# EAGLE design arduino_aprs_modem - corrected (EAGLE 9.6.2)
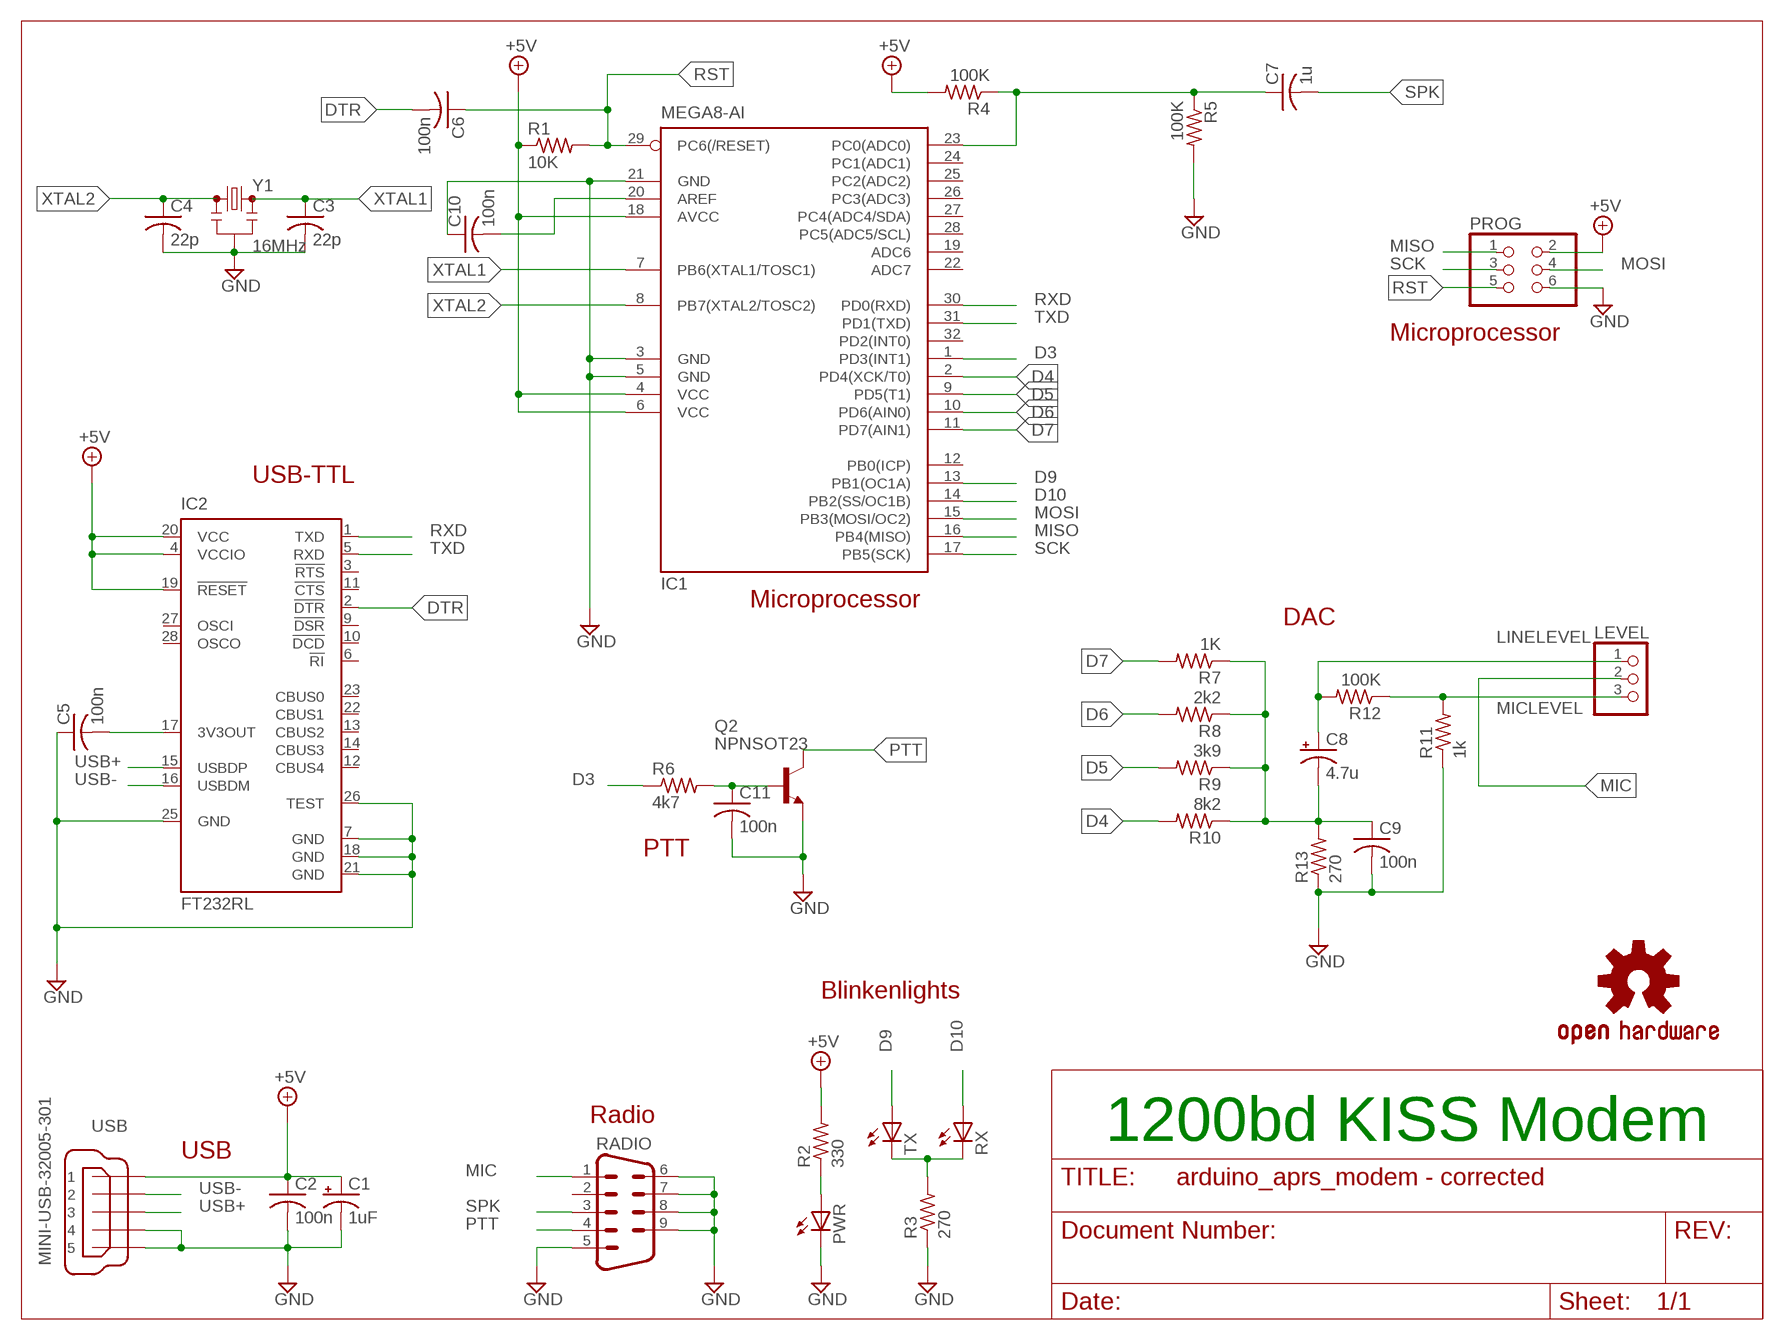
[diagram p0: schematic, sheet 1]

## Parts
C1  1uF  CPOL-USE2-5  [E2-5]
C2  100n  C-USC0805  [C0805]
C3  22p  C-USC0805  [C0805]
C4  22p  C-USC0805  [C0805]
C5  100n  C-USC0805  [C0805]
C6  100n  C-USC0805  [C0805]
C7  1u  C-USC0805  [C0805]
C8  4.7u  CPOL-USE2-5  [E2-5]
C9  100n  C-USC0805  [C0805]
C10  100n  C-USC0805  [C0805]
C11  100n  C-USC0805  [C0805]
IC1  MEGA8-AI  [TQFP32-08]
IC2  FT232RL  [SSOP28]
LEVEL  PINHD-1X3  [1X03]
PROG  PINHD-2X3  [2X03]
PWR  LEDCHIPLED_0805  [CHIPLED_0805]
Q2  NPNSOT23  [SOT23]
R1  10K  R-US_M0805  [M0805]
R2  330  R-US_M0805  [M0805]
R3  270  R-US_M0805  [M0805]
R4  100K  R-US_M0805  [M0805]
R5  100K  R-US_M0805  [M0805]
R6  4k7  R-US_M0805  [M0805]
R7  1K  R-US_M0805  [M0805]
R8  2k2  R-US_M0805  [M0805]
R9  3k9  R-US_M0805  [M0805]
R10  8k2  R-US_M0805  [M0805]
R11  1k  R-US_M0805  [M0805]
R12  100K  R-US_M0805  [M0805]
R13  270  R-US_M0805  [M0805]
RADIO  M09H  [M09H]
RX  LEDCHIPLED_0805  [CHIPLED_0805]
TX  LEDCHIPLED_0805  [CHIPLED_0805]
U$1  OSHW-LOGOM  [OSHW-LOGO-M]
USB  MINI-USB-32005-301  [32005-301]
Y1  16MHz  RESONATORPTH  [RESONATOR-PTH]

## Nets
+5V: C1.+ C2.1 IC1.4(VCC) IC1.6(VCC) IC1.18(AVCC) IC2.4(VCCIO) IC2.19(!RESET) IC2.20(VCC) PROG.2 R1.1 R2.2 R4.2 USB.1
D3: IC1.1(PD3(INT1)) R6.1
D4: IC1.2(PD4(XCK/T0)) R10.2
D5: IC1.9(PD5(T1)) R9.2
D6: IC1.10(PD6(AIN0)) R8.2
D7: IC1.11(PD7(AIN1)) R7.2
D9: IC1.13(PB1(OC1A)) TX.A
D10: IC1.14(PB2(SS/OC1B)) RX.A
DTR: C6.2 IC2.2(!DTR)
GND: C1.- C2.2 C3.2 C4.2 C5.1 C9.2 C10.1 C11.2 IC1.3(GND) IC1.5(GND) IC1.21(GND) IC2.7(GND) IC2.18(GND) IC2.21(GND) IC2.25(GND) IC2.26(TEST) PROG.6 PWR.C Q2.2(E) R3.1 R5.2 R11.1 R13.1 RADIO.5 RADIO.6 RADIO.7 RADIO.8 RADIO.9 USB.4 USB.5 Y1.2
LINELEVEL: C8.+ LEVEL.1 R12.2
MIC: LEVEL.2 RADIO.1
MICLEVEL: LEVEL.3 R11.2 R12.1
MISO: IC1.16(PB4(MISO)) PROG.1
MOSI: IC1.15(PB3(MOSI/OC2)) PROG.4
N$1: C10.2 IC1.20(AREF)
N$2: PWR.A R2.1
N$3: R3.2 RX.C TX.C
N$6: C7.1 IC1.23(PC0(ADC0)) R4.1 R5.1
N$7: C11.1 Q2.1(B) R6.2
N$9: C5.2 IC2.17(3V3OUT)
N$13: C8.- C9.1 R7.1 R8.1 R9.1 R10.1 R13.2
PTT: Q2.3(C) RADIO.4
RST: C6.1 IC1.29(PC6(/RESET)) PROG.5 R1.2
RXD: IC1.30(PD0(RXD)) IC2.1(TXD)
SCK: IC1.17(PB5(SCK)) PROG.3
SPK: C7.2 RADIO.3
TXD: IC1.31(PD1(TXD)) IC2.5(RXD)
USB+: IC2.15(USBDP) USB.3
USB-: IC2.16(USBDM) USB.2
XTAL1: C3.1 IC1.7(PB6(XTAL1/TOSC1)) Y1.3
XTAL2: C4.1 IC1.8(PB7(XTAL2/TOSC2)) Y1.1
Unconnected: IC1.12(PB0(ICP)) IC1.19(ADC6) IC1.22(ADC7) IC1.24(PC1(ADC1)) IC1.25(PC2(ADC2)) IC1.26(PC3(ADC3)) IC1.27(PC4(ADC4/SDA)) IC1.28(PC5(ADC5/SCL)) IC1.32(PD2(INT0)) IC2.3(!RTS) IC2.6(!RI) IC2.9(!DSR) IC2.10(!DCD) IC2.11(!CTS) IC2.12(CBUS4) IC2.13(CBUS2) IC2.14(CBUS3) IC2.22(CBUS1) IC2.23(CBUS0) IC2.27(OSCI) IC2.28(OSCO) RADIO.2

## Notes on the sheet
- Microprocessor
- USB-TTL
- Microprocessor
- DAC
- PTT
- Blinkenlights
- Radio
- 1200bd KISS Modem
- USB

## Library data of the parts
C1 C8 = rcl:CPOL-US: POLARIZED CAPACITOR, American symbol
C2-C7 C9-C11 = rcl:C-US: CAPACITOR, American symbol
IC1 = atmel:MEGA8: MICROCONTROLLER 8 Kbytes FLASH, 1 kbytes SRAM, 512 bytes EEPROM, USART, 6-channel 10 bit ADC, 2-channel 8 bit ADC Pin compatible with Atmega48, ATMega88, ATMega168 Source: avr.lbr; MPN: ATMEGA8-16AU; OC_FARNELL: 9171371; OC_NEWARK: 73M8863
IC2 = ftdichip:FT232R: Source: http://www.ftdichip.com/Documents/DataSheets/DS_FT232R_v104.pdf; MPN: FT232RL; OC_FARNELL: 1146032; OC_NEWARK: 91K9918
LEVEL = pinhead:PINHD-1X3: PIN HEADER
PROG = pinhead:PINHD-2X3: PIN HEADER
PWR RX TX = led:LED: LED OSRAM: - CHIPLED LG R971, LG N971, LY N971, LG Q971, LY Q971, LO R971, LY R971 LH N974, LH R974 LS Q976, LO Q976, LY Q976 LO Q996 - Hyper CHIPLED LW Q18S LB Q993, LB Q99A, LB R99A - SideLED LS A670, LO A670, LY A670, LG A670, LP A670 LB A673, LV A673, LT A673, LW A673 LH A674 LY A675 LS A676, LA A676, LO A676, LY A676, LW A676 LS A679, LY A679, LG A679 - Hyper Micro SIDELED® LS Y876, LA Y876, LO Y876, LY Y876 LT Y87S - SmartLED LW L88C, LW L88S LB L89C, LB L89S, LG L890 LS L89K, LO L89K, LY L89K LS L896, LA L896, LO L896, LY L896 - TOPLED LS T670, LO T670, LY T670, LG T670, LP T670 LSG T670, LSP T670, LSY T670, LOP T670, LYG T670 LG T671, LOG T671, LSG T671 LB T673, LV T673, LT T673, LW T673 LH T674 LS T676, LA T676, LO T676, LY T676, LB T676, LH T676, LSB T676, LW T676 LB T67C, LV T67C, LT T67C, LS T67K, LO T67K, LY T67K, LW E67C LS E67B, LA E67B, LO E67B, LY E67B, LB E67C, LV E67C, LT E67C LW T67C LS T679, LY T679, LG T679 LS T770, LO T770, LY T770, LG T770, LP T770 LB T773, LV T773, LT T773, LW T773 LH T774 LS E675, LA E675, LY E675, LS T675 LS T776, LA T776, LO T776, LY T776, LB T776 LHGB T686 LT T68C, LB T68C - Hyper Mini TOPLED® LB M676 - Mini TOPLED Santana® LG M470 LS M47K, LO M47K, LY M47K Source: http://www.osram.convergy.de LUXEON: - LUMILED® LXK2-PW12-R00, LXK2-PW12-S00, LXK2-PW14-U00, LXK2-PW14-V00 LXK2-PM12-R00, LXK2-PM12-S00, LXK2-PM14-U00 LXK2-PE12-Q00, LXK2-PE12-R00, LXK2-PE12-S00, LXK2-PE14-T00, LXK2-PE14-U00 LXK2-PB12-K00, LXK2-PB12-L00, LXK2-PB12-M00, LXK2-PB14-N00, LXK2-PB14-P00, LXK2-PB14-Q00 LXK2-PR12-L00, LXK2-PR12-M00, LXK2-PR14-Q00, LXK2-PR14-R00 LXK2-PD12-Q00, LXK2-PD12-R00, LXK2-PD12-S00 LXK2-PH12-R00, LXK2-PH12-S00 LXK2-PL12-P00, LXK2-PL12-Q00, LXK2-PL12-R00 Source: www.luxeon.com KINGBRIGHT: KA-3528ASYC Source: www.kingbright.com
Q2 = Jim:NPN: NPN Transistor
R1-R13 = resistor:R-US_: RESISTOR, American symbol
RADIO = con-subd:M09: SUB-D; OC_FARNELL: unknown; OC_NEWARK: unknown
U$1 = SparkFun:OSHW-LOGO: Open Source Hardware Logo This logo indicates the piece of hardware it is found on incorporates a OSHW license and/or adheres to the definition of open source hardware found here: http://freedomdefined.org/OSHW
USB = con-cypressindustries:MINI-USB-: MINI USB-B Conector Source: www.cypressindustries.com; OC_FARNELL: unknown; OC_NEWARK: unknown
Y1 = SparkFun-FreqCtrl:RESONATOR: Resonator Small SMD resonator. Used, eg, on the Arduino Pro/ Pro Mini boards. 8MHz- XTAL-08895 16MHz- XTAL-08900

## Board
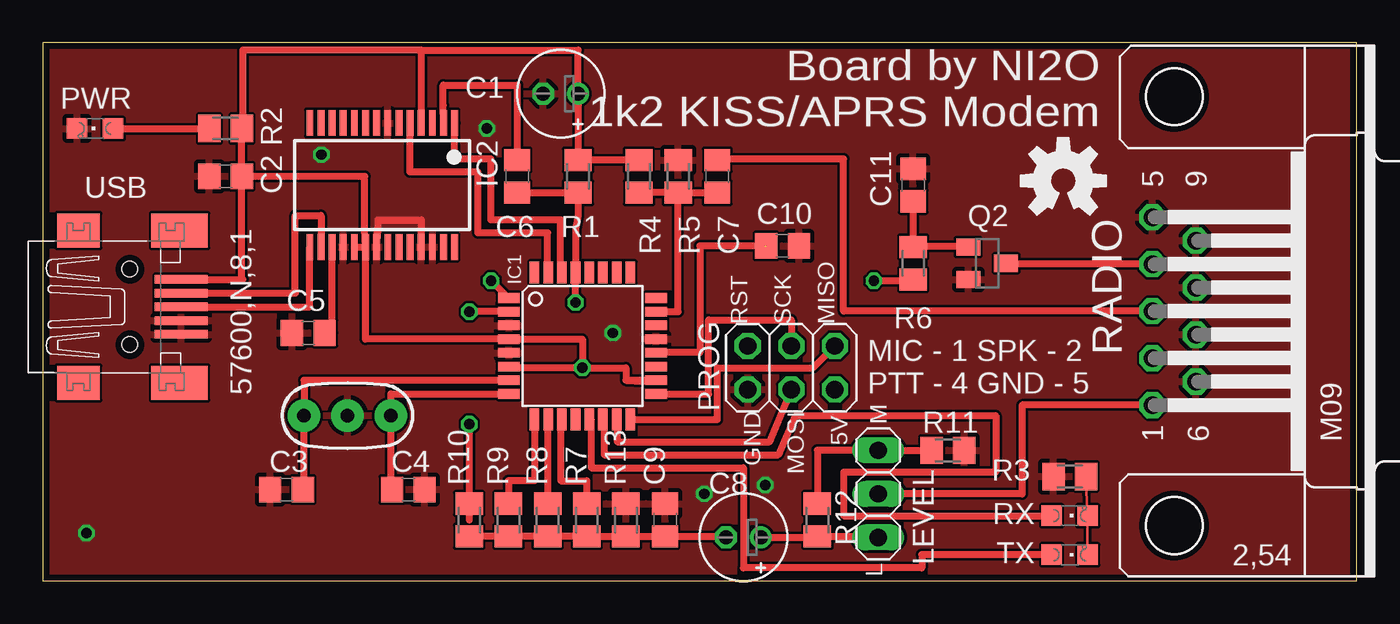
[diagram p1: board, top side]
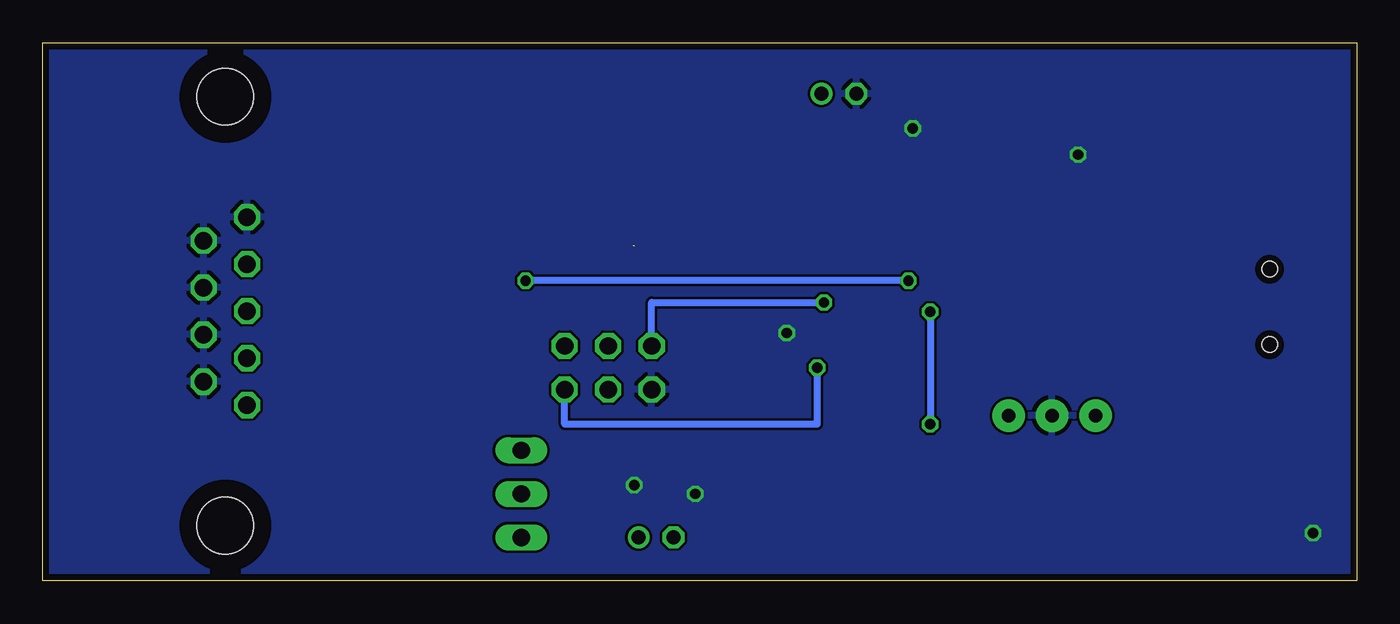
[diagram p2: board, bottom side, seen from below]

Size 76.69 x 31.42 mm. Coordinates in mm from the lower left corner, seen from the top.
Outline: 0,0 76.69,0 76.69,31.42 0,31.42 0,0
Copper layers (1*16): Top 0.0356mm / dielectric 1.5011mm / Bottom 0.0356mm
Design rules "LaenPCBOrder": minimum track width 6mil, minimum drill 13mil, track to track 6mil, track to pad 6mil, pad to pad 6mil, via to via 6mil, smd to smd 6mil, copper to edge 15mil, drill to drill 6mil, minimum pad ring 7mil, minimum via ring 7mil, stop-mask expansion 3mil, vias tented up to drill 0mil, thermal gap 10mil

### Footprints (pad centres in the part's own frame; a part is rotated, then mirrored left to right if it is on the bottom)
E2-5 = drill 0.813 pad 1.27: + -1.016,0 | drill 0.813 pad 1.27 octagon: - 1.016,0
C0805 = smd 1.3 x 1.5: 1 -0.95,0; 2 0.95,0
TQFP32-08 = smd 1.27 x 0.559: 1 -4.293,2.8; 2 -4.293,2; 3 -4.293,1.2; 4 -4.293,0.4; 5 -4.293,-0.4; 6 -4.293,-1.2; 7 -4.293,-2; 8 -4.293,-2.8; 17 4.293,-2.8; 18 4.293,-2; 19 4.293,-1.2; 20 4.293,-0.4; 21 4.293,0.4; 22 4.293,1.2; 23 4.293,2; 24 4.293,2.8 | smd 0.559 x 1.27: 9 -2.8,-4.293; 10 -2,-4.293; 11 -1.2,-4.293; 12 -0.4,-4.293; 13 0.4,-4.293; 14 1.2,-4.293; 15 2,-4.293; 16 2.8,-4.293; 25 2.8,4.293; 26 2,4.293; 27 1.2,4.293; 28 0.4,4.293; 29 -0.4,4.293; 30 -1.2,4.293; 31 -2,4.293; 32 -2.8,4.293
SSOP28 = smd 0.4 x 1.5: 1 -4.225,-3.625; 2 -3.575,-3.625; 3 -2.925,-3.625; 4 -2.275,-3.625; 5 -1.625,-3.625; 6 -0.975,-3.625; 7 -0.325,-3.625; 8 0.325,-3.625; 9 0.975,-3.625; 10 1.625,-3.625; 11 2.275,-3.625; 12 2.925,-3.625; 13 3.575,-3.625; 14 4.225,-3.625; 15 4.225,3.625; 16 3.575,3.625; 17 2.925,3.625; 18 2.275,3.625; 19 1.625,3.625; 20 0.975,3.625; 21 0.325,3.625; 22 -0.325,3.625; 23 -0.975,3.625; 24 -1.625,3.625; 25 -2.275,3.625; 26 -2.925,3.625; 27 -3.575,3.625; 28 -4.225,3.625
1X03 = drill 1.016 long: 1 -2.54,0; 2 0,0; 3 2.54,0
2X03 = drill 1.016 octagon: 1 -2.54,-1.27; 2 -2.54,1.27; 3 0,-1.27; 4 0,1.27; 5 2.54,-1.27; 6 2.54,1.27
CHIPLED_0805 = smd 1.2 x 1.2: A 0,-1.05; C 0,1.05
SOT23 = smd 1 x 1.4: 1 -0.95,-1.1; 2 0.95,-1.1; 3 0,1.1
M0805 = smd 1.3 x 1.6: 1 -0.95,0; 2 0.95,0
M09H = drill 1.016 octagon: 1 -5.486,1.27; 2 -2.743,1.27; 3 0,1.27; 4 2.743,1.27; 5 5.486,1.27; 6 -4.115,-1.27; 7 -1.372,-1.27; 8 1.372,-1.27; 9 4.115,-1.27 | hole 3.302: 12.522,0; -12.522,0
32005-301 = smd 3.1 x 0.5: 1 3,1.6; 2 3,0.8; 3 3,0; 4 3,-0.8; 5 3,-1.6 | smd 2.5 x 2: M1 -3,-4.45; M2 -3,4.45 | smd 3.3 x 2: M3 2.9,4.45; M4 2.9,-4.45 | hole 0.9: 0,2.2; 0,-2.2
RESONATOR-PTH = drill 0.8 pad 1.88: 1 -2.54,0; 2 0,0; 3 2.54,0

### Placement (x,y rotation side)
C1  30.23,28.45 180 top
C2  10.67,23.62 180 top
C3  14.22,5.33 180 top
C4  21.34,5.33 0 top
C5  15.49,14.48 0 top
C6  27.69,23.62 90 top
C7  39.37,23.62 90 top
C8  40.89,2.54 180 top
C9  36.32,3.56 90 top
C10  43.18,19.56 180 top
C11  50.8,23.11 90 top
IC1  31.5,13.72 0 top
IC2  19.81,23.11 180 top
LEVEL  48.77,5.08 90 top
PROG  43.69,12.45 180 top
PWR  3.05,26.42 90 top
Q2  55.12,18.54 270 top
R1  31.24,23.62 270 top
R2  10.67,26.42 0 top
R3  59.94,6.1 0 top
R4  34.8,23.62 90 top
R5  37.08,23.62 90 top
R6  50.8,18.54 90 top
R7  31.75,3.56 90 top
R8  29.46,3.56 90 top
R9  27.18,3.56 90 top
R10  24.89,3.56 90 top
R11  52.83,7.62 180 top
R12  45.21,3.56 270 top
R13  34.04,3.56 270 top
RADIO  66.04,15.75 90 top
RX  59.94,3.81 270 top
TX  59.94,1.52 270 top
U$1  59.56,23.37 0 top
USB  5.08,16 0 top
Y1  17.78,9.65 180 top

### Tracks (layer width: path | path; a pad name or v marks a point on that pad's centre or on a via)
+5V  (via drill 0.6)
  Top 0.406: IC2.4 22.1,27.75 22.1,30.99 | 22.1,30.99 31.24,30.99 C1.+ R1.1 R4.2 | IC2.20 18.8,20.5 18.8,23.62 C2.1 | USB.1 11.62,17.6 | R2.2 11.68,25.91 | 11.68,17.6 11.62,17.6 | 11.62,17.6 C2.1 | C2.1 R2.2 | IC2.19 IC2.20 | 22.1,30.99 11.68,30.99 11.68,26.42 R2.2 | IC2.20 18.84,14.12 IC1.4 31.5,14.12 v31.5,12.45 | v31.5,12.45 27.2,12.45 IC1.6 | 34.04,11.72 IC1.18 35.79,11.68 34.54,11.68 34.04,11.72 | v31.5,12.45 34.04,12.45 34.04,11.72
  Bottom 0.406: v31.5,12.45 31.5,9.14 46.23,9.14 PROG.2
D3  (via drill 0.6)
  Top 0.406: IC1.1 27.18,16.52 v26.16,17.53 | v48.51,17.53 50.8,17.53 R6.1
  Bottom 0.406: v26.16,17.53 v48.51,17.53
D4  (via drill 0.6)
  Top 0.406: IC1.2 v24.89,15.72 24.89,15.75 | v24.89,9.14 R10.2 24.89,3.56
  Bottom 0.406: v24.89,15.72 v24.89,9.14
D5
  Top 0.406: IC1.9 28.7,9.17 28.7,5.84 27.18,5.84 R9.2
D6
  Top 0.406: IC1.10 29.46,9.42 R8.2
D7
  Top 0.406: IC1.11 30.23,9.42 30.23,5.84 31.75,5.84 R7.2
D9
  Top 0.406: IC1.13 32,9.42 32,6.6 40.89,6.6 40.89,0.76 51.31,0.76 51.31,1.52 TX.A
D10
  Top 0.406: IC1.14 32.77,9.42 32.77,7.37 42.93,7.37 43.94,9.65 55.63,9.65 55.63,6.35 46.74,6.35 46.74,3.81 RX.A
DTR
  Top 0.406: IC2.2 23.37,27.75 23.37,28.96 27.69,28.96 C6.2
GND  (via drill 0.6)
  Top 0.406: IC2.21 19.56,20.5 19.56,21.08 22.09,21.08 IC2.25
  other vias: 2.54,2.79 16.26,24.89 33.27,14.48 25.91,26.42 38.61,5.08 42.16,5.59
  pour Bottom: 0,0 76.71,0 76.71,31.5 0,31.5
  pour Top: 0,0 76.71,0 76.71,31.5 0,31.5
LINELEVEL
  Top 0.406: C8.+ 45.72,2.54 R12.2 48.77,2.61 LEVEL.1
MIC
  Top 0.406: RADIO.1 57.15,10.26 57.15,5.08 LEVEL.2
MICLEVEL
  Top 0.406: R11.2 LEVEL.3 45.21,7.62 R12.1
MISO
  Top 0.406: IC1.16 39.37,9.42 39.37,12.45 44.96,12.45 PROG.1
MOSI
  Top 0.406: IC1.15 33.53,9.42 33.53,8.13 42.42,8.13 PROG.4
N$1  (1 unrouted)
  Top 0.406: IC1.20 35.79,13.34 38.35,13.34 38.35,19.56 42.16,19.56
N$2
  Top 0.406: PWR.A R2.1
N$3
  Top 0.152: 60.96,3.81 60.96,1.52 TX.C | 60.96,3.81 R3.2 | 60.96,3.81 RX.C
N$6
  Top 0.406: R5.1 C7.1 | IC1.23 37.08,15.72 R5.1 | R5.1 R4.1
N$7
  Top 0.152: 54.1,19.56 Q2.1 | 51.05,19.56 R6.2
  Top 0.406: 51.05,19.56 54.1,19.56 | C11.1 R6.2
N$9
  Top 0.406: C5.2 16.89,14.48 IC2.17
N$13
  Top 0.406: R10.1 R9.1 R8.1 R7.1 R13.2 C9.1 39.88,2.61 C8.-
PTT
  Top 0.406: Q2.3 64.77,18.54 RADIO.4
RST  (via drill 0.6)
  Top 0.406: C6.1 R1.2 31.24,21.34 31.1,20.57 IC1.29 v31.1,16.26
  Bottom 0.406: PROG.5 41.15,16.26 v31.1,16.26
RXD
  Top 0.406: IC1.30 30.23,18.01 30.23,21.08 26.16,21.08 26.16,24.64 24.04,24.64 IC2.1
SCK
  Top 0.406: IC1.17 38.86,10.92 38.86,15.24 43.69,15.24 PROG.3
SPK
  Top 0.406: RADIO.3 46.74,15.75 46.74,24.64 39.37,24.64 C7.2
TXD
  Top 0.406: IC1.31 29.46,18.01 29.46,20.32 25.4,20.32 25.4,23.88 21.44,23.88 IC2.5
USB+
  Top 0.406: USB.3 15.59,16 IC2.15
USB-
  Top 0.406: USB.2 14.73,16.8 14.73,21.34 16.24,21.34 IC2.16
XTAL1
  Top 0.406: IC1.7 15.24,11.72 Y1.3 15.24,5.33 C3.1
XTAL2
  Top 0.406: C4.1 20.32,5.33 Y1.1 20.32,10.92 IC1.8

### Text on the board
tNames: Board by NI2O / 1k2 KISS/APRS Modem | 57600,N,8,1 | RST | SCK | MISO | MIC - 1 SPK - 2 / PTT - 4 GND - 5 | GND | MOSI | 5V | M | L